# EAGLE schematic Adafruit_MAX31865 (EAGLE 9.3.0)
COMPANY: ADAFRUIT INDUSTRIES; DRAWN: KTOWN; REV: A
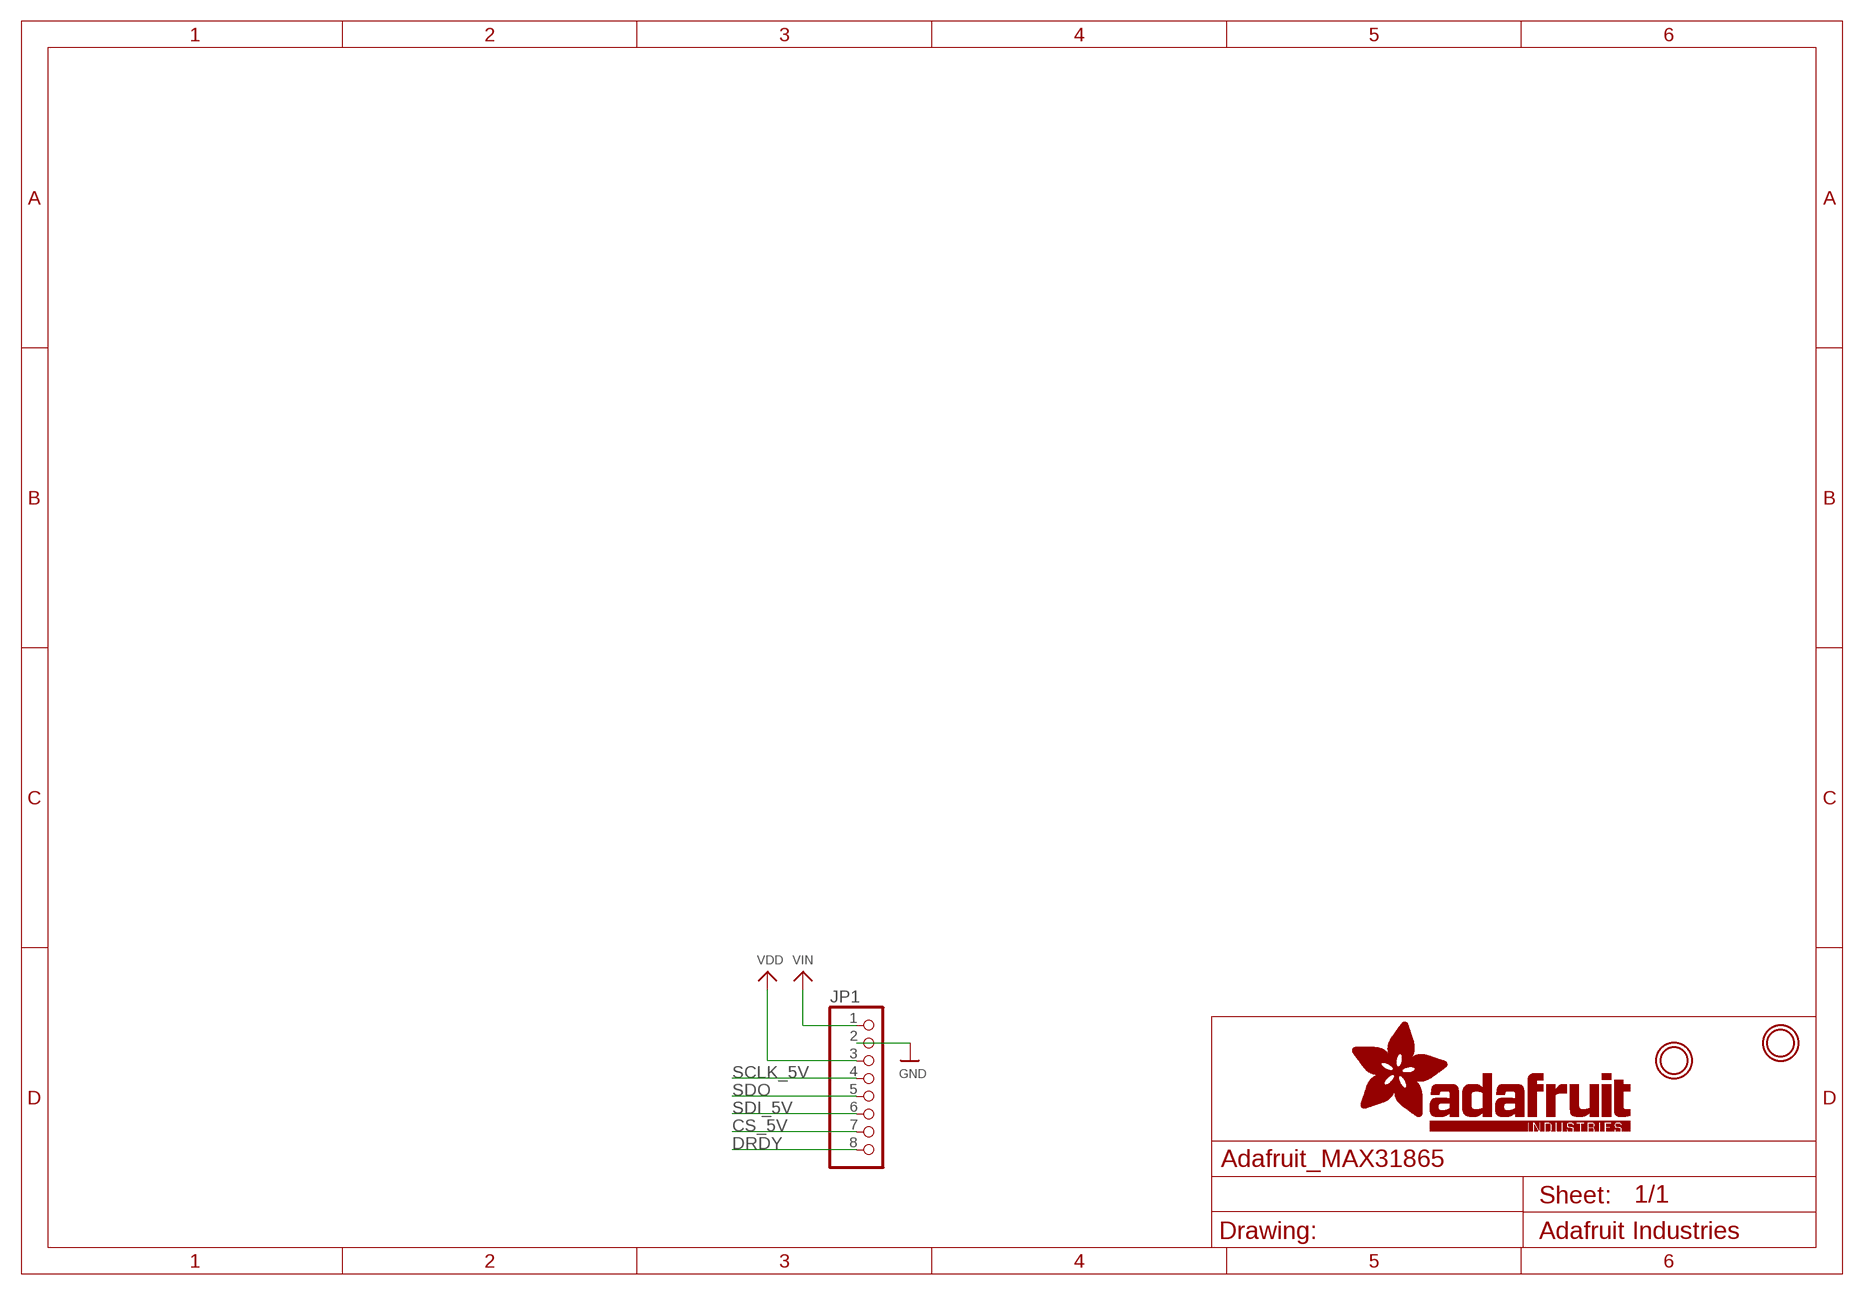
[diagram p0: schematic, sheet 1]

## Parts
JP1  HEADER-1X870MIL  [1X08_ROUND_70]
U$18  MOUNTINGHOLE2.5  [MOUNTINGHOLE_2.5_PLATED]
U$19  MOUNTINGHOLE2.5  [MOUNTINGHOLE_2.5_PLATED]

## Nets
CS_5V: JP1.7
DRDY: JP1.8
GND: JP1.2
SCLK_5V: JP1.4
SDI_5V: JP1.6
SDO: JP1.5
VDD: JP1.3
VIN: JP1.1

## Library data of the parts
JP1 = microbuilder:HEADER-1X8: PIN HEADER
U$18 U$19 = microbuilder:MOUNTINGHOLE: Mounting Hole For #2 screws (0.086"/2.18mm width, 0.094"/2.4mm hole) use 2.5mm; BOM: EXCLUDE